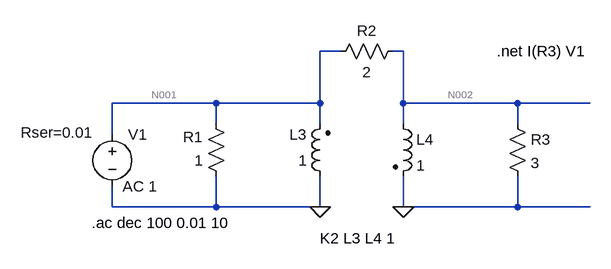
[diagram p0: schematic punto1.asc]
punto1.asc, the LTspice schematic file:
Version 4
SHEET 1 880 680
WIRE 96 224 64 224
WIRE 192 224 176 224
WIRE -96 304 -256 304
WIRE 64 304 64 224
WIRE 64 304 -96 304
WIRE 192 304 192 224
WIRE 368 304 192 304
WIRE 480 304 368 304
WIRE -96 336 -96 304
WIRE 64 336 64 304
WIRE 192 336 192 304
WIRE 368 336 368 304
WIRE -256 352 -256 304
WIRE -256 464 -256 432
WIRE -96 464 -96 416
WIRE -96 464 -256 464
WIRE 64 464 64 416
WIRE 64 464 -96 464
WIRE 192 464 192 416
WIRE 368 464 368 416
WIRE 368 464 192 464
WIRE 480 464 368 464
FLAG 64 464 0
FLAG 192 464 0
SYMBOL ind2 80 432 R180
WINDOW 0 36 80 Left 2
WINDOW 3 36 40 Left 2
SYMATTR InstName L3
SYMATTR Value 1
SYMBOL ind2 176 320 R0
SYMATTR InstName L4
SYMATTR Value 1
SYMBOL res -80 432 R180
WINDOW 0 36 76 Left 2
WINDOW 3 36 40 Left 2
SYMATTR InstName R1
SYMATTR Value 1
SYMBOL res 80 240 R270
WINDOW 0 32 56 VTop 2
WINDOW 3 0 56 VBottom 2
SYMATTR InstName R2
SYMATTR Value 2
SYMBOL res 352 320 R0
SYMATTR InstName R3
SYMATTR Value 3
SYMBOL voltage -256 336 R0
WINDOW 123 16 96 Left 2
WINDOW 39 -141 13 Left 2
SYMATTR Value2 AC 1
SYMATTR SpiceLine Rser=0.01
SYMATTR InstName V1
SYMATTR Value ""
TEXT 336 224 Left 2 !.net I(R3) V1
TEXT -288 488 Left 2 !.ac dec 100 0.01 10
TEXT 64 512 Left 2 !K2 L3 L4 1

The netlist it stands for:
* punto1.asc
L3 0 N001 1
L4 N002 0 1
R1 0 N001 1
R2 N001 N002 2
R3 N002 0 3
V1 N001 0 AC 1 Rser=0.01
.net I(R3) V1
.ac dec 100 0.01 10
K2 L3 L4 1
.backanno
.end

* Results of the author's LTspice run, read from the files saved beside the schematic
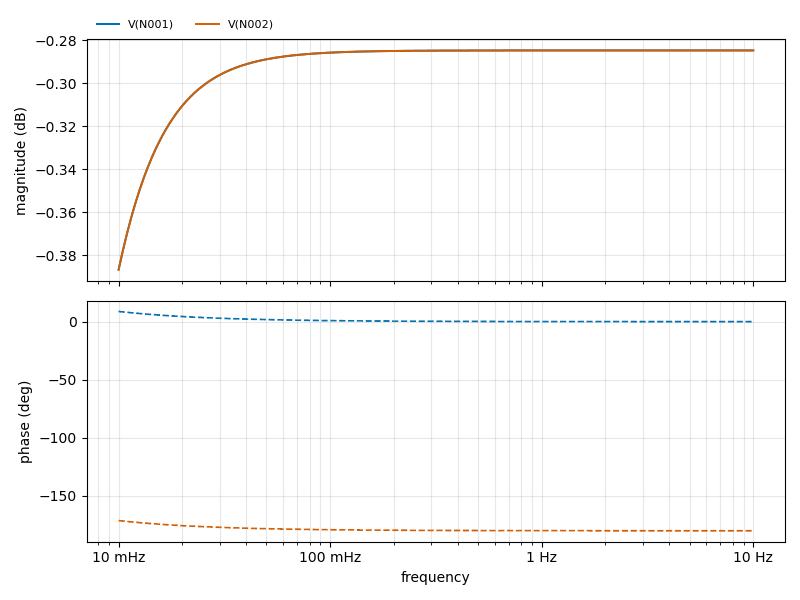
[diagram p1: AC Analysis of punto1.asc, plotted from the saved traces]
* AC Analysis, 1 run:
*   V(N001): -0.39 dB at 10 mHz, -0.28 dB at 10 Hz, peak -0.28 dB at 10 Hz
*   V(N002): -0.39 dB at 10 mHz, -0.28 dB at 10 Hz, peak -0.28 dB at 10 Hz